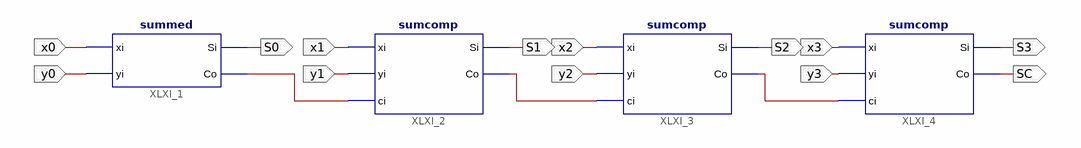
[diagram p0: schematic sheet 1]
// Xilinx ISE schematic sumador_completo_4b.sch (spartan6) as structural Verilog: 4 symbols, 13 ports
module sumador_completo_4b (
  input  x0,
  input  y0,
  input  x1,
  input  y1,
  input  x2,
  input  y2,
  input  x3,
  input  y3,
  output S0,
  output S1,
  output S2,
  output S3,
  output SC
);

  wire XLXN_1, XLXN_2, XLXN_3;

  summed XLXI_1 (.xi(x0), .yi(y0), .Si(S0), .Co(XLXN_1));
  sumcomp XLXI_2 (.ci(XLXN_1), .Co(XLXN_2), .Si(S1), .xi(x1), .yi(y1));
  sumcomp XLXI_3 (.ci(XLXN_2), .Co(XLXN_3), .Si(S2), .xi(x2), .yi(y2));
  sumcomp XLXI_4 (.ci(XLXN_3), .Co(SC), .Si(S3), .xi(x3), .yi(y3));
endmodule
